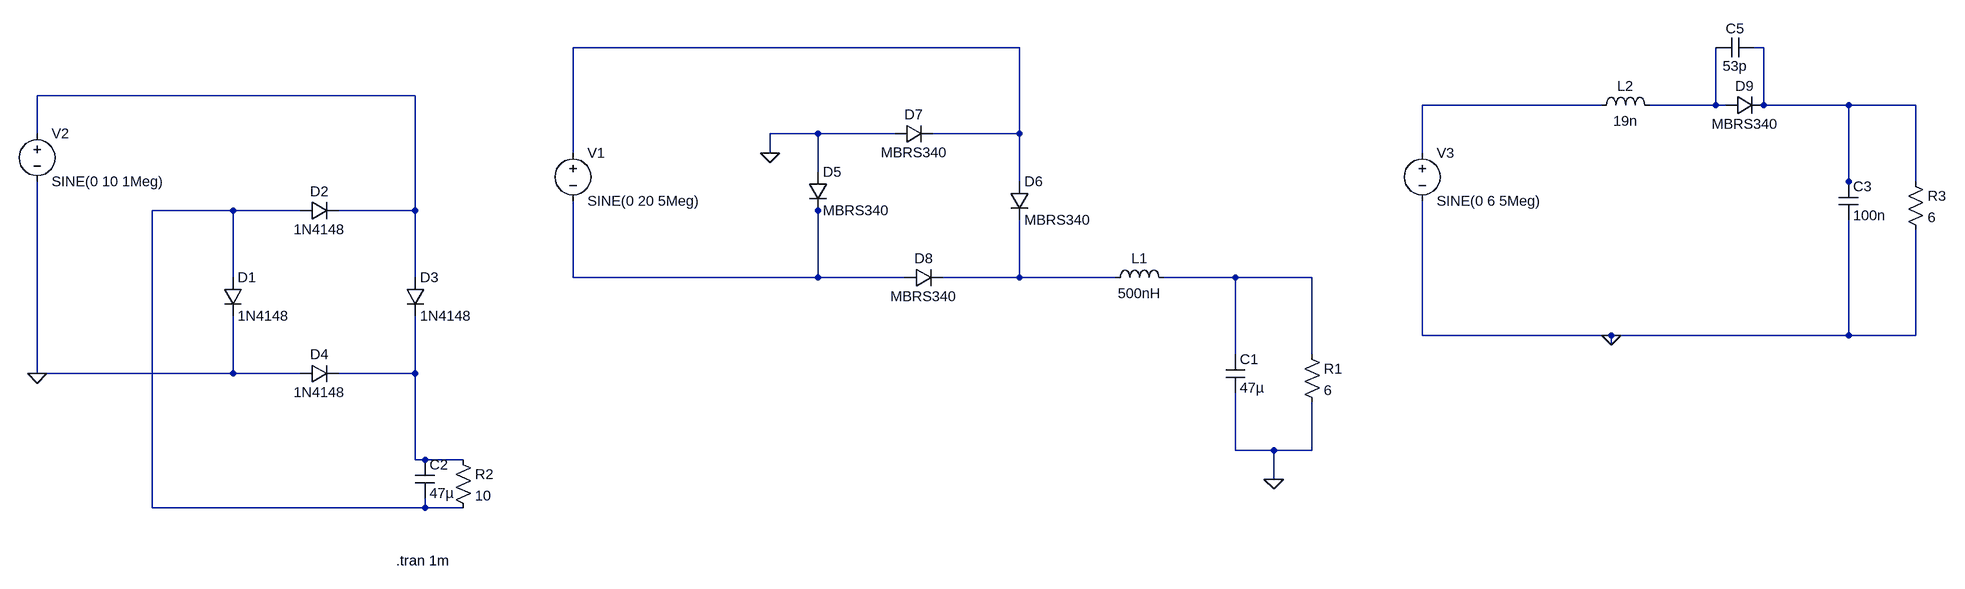
[diagram p0: schematic rectifier.asc]
rectifier.asc, the LTspice schematic file:
Version 4.1
SHEET 1 5448 680
WIRE 3248 -336 2352 -336
WIRE 5104 -336 5088 -336
WIRE 1664 -256 992 -256
WIRE 4800 -240 4416 -240
WIRE 5024 -240 5024 -336
WIRE 5024 -240 4880 -240
WIRE 5040 -240 5024 -240
WIRE 5104 -240 5104 -336
WIRE 5280 -240 5104 -240
WIRE 5392 -240 5280 -240
WIRE 992 -192 992 -256
WIRE 2912 -192 2832 -192
WIRE 3040 -192 2912 -192
WIRE 3248 -192 3248 -336
WIRE 3248 -192 3104 -192
WIRE 2352 -160 2352 -336
WIRE 2832 -160 2832 -192
WIRE 4416 -160 4416 -240
WIRE 2912 -128 2912 -192
WIRE 3248 -112 3248 -192
WIRE 5280 -112 5280 -240
WIRE 5392 -112 5392 -240
WIRE 5280 -96 5280 -112
WIRE 1360 -64 1184 -64
WIRE 1472 -64 1360 -64
WIRE 1664 -64 1664 -256
WIRE 1664 -64 1536 -64
WIRE 2912 -64 2912 -80
WIRE 1360 48 1360 -64
WIRE 1664 48 1664 -64
WIRE 2352 48 2352 -80
WIRE 2912 48 2912 -64
WIRE 2912 48 2352 48
WIRE 3056 48 2912 48
WIRE 3248 48 3248 -48
WIRE 3248 48 3120 48
WIRE 3408 48 3248 48
WIRE 3616 48 3488 48
WIRE 3744 48 3616 48
WIRE 4416 144 4416 -80
WIRE 4816 144 4416 144
WIRE 5280 144 5280 -48
WIRE 5280 144 4816 144
WIRE 5392 144 5392 -32
WIRE 5392 144 5280 144
WIRE 4816 160 4816 144
WIRE 3616 176 3616 48
WIRE 3744 176 3744 48
WIRE 992 208 992 -112
WIRE 1360 208 1360 112
WIRE 1360 208 992 208
WIRE 1472 208 1360 208
WIRE 1664 208 1664 112
WIRE 1664 208 1536 208
WIRE 3616 336 3616 240
WIRE 3680 336 3616 336
WIRE 3744 336 3744 256
WIRE 3744 336 3680 336
WIRE 1664 352 1664 208
WIRE 1680 352 1664 352
WIRE 1744 352 1680 352
WIRE 3680 384 3680 336
WIRE 1184 432 1184 -64
WIRE 1680 432 1680 416
WIRE 1680 432 1184 432
WIRE 1744 432 1680 432
FLAG 992 208 0
FLAG 2832 -160 0
FLAG 3680 384 0
FLAG 4816 144 0
SYMBOL diode 1344 48 R0
SYMATTR InstName D1
SYMATTR Value 1N4148
SYMBOL diode 1472 224 R270
WINDOW 0 32 32 VTop 2
WINDOW 3 0 32 VBottom 2
SYMATTR InstName D4
SYMATTR Value 1N4148
SYMBOL diode 1648 48 R0
SYMATTR InstName D3
SYMATTR Value 1N4148
SYMBOL diode 1472 -48 R270
WINDOW 0 32 32 VTop 2
WINDOW 3 0 32 VBottom 2
SYMATTR InstName D2
SYMATTR Value 1N4148
SYMBOL res 1728 336 R0
SYMATTR InstName R2
SYMATTR Value 10
SYMBOL cap 1664 352 R0
SYMATTR InstName C2
SYMATTR Value 47µ
SYMBOL voltage 992 -208 R0
WINDOW 123 0 0 Left 0
WINDOW 39 0 0 Left 0
SYMATTR InstName V2
SYMATTR Value SINE(0 10 1Meg)
SYMBOL voltage 2352 -176 R0
WINDOW 123 0 0 Left 0
WINDOW 39 0 0 Left 0
SYMATTR InstName V1
SYMATTR Value SINE(0 20 5Meg)
SYMBOL diode 2896 -128 R0
SYMATTR InstName D5
SYMATTR Value MBRS340
SYMBOL diode 3232 -112 R0
SYMATTR InstName D6
SYMATTR Value MBRS340
SYMBOL diode 3040 -176 R270
WINDOW 0 32 32 VTop 2
WINDOW 3 0 32 VBottom 2
SYMATTR InstName D7
SYMATTR Value MBRS340
SYMBOL diode 3056 64 R270
WINDOW 0 32 32 VTop 2
WINDOW 3 0 32 VBottom 2
SYMATTR InstName D8
SYMATTR Value MBRS340
SYMBOL ind 3392 64 R270
WINDOW 0 32 56 VTop 2
WINDOW 3 5 56 VBottom 2
SYMATTR InstName L1
SYMATTR Value 500nH
SYMBOL cap 3600 176 R0
SYMATTR InstName C1
SYMATTR Value 47µ
SYMBOL res 3728 160 R0
SYMATTR InstName R1
SYMATTR Value 6
SYMBOL voltage 4416 -176 R0
WINDOW 123 0 0 Left 0
WINDOW 39 0 0 Left 0
SYMATTR InstName V3
SYMATTR Value SINE(0 6 5Meg)
SYMBOL cap 5264 -112 R0
SYMATTR InstName C3
SYMATTR Value 100n
SYMBOL res 5376 -128 R0
SYMATTR InstName R3
SYMATTR Value 6
SYMBOL ind 4784 -224 R270
WINDOW 0 32 56 VTop 2
WINDOW 3 5 56 VBottom 2
SYMATTR InstName L2
SYMATTR Value 19n
SYMBOL diode 5040 -224 R270
WINDOW 0 32 32 VTop 2
WINDOW 3 0 32 VBottom 2
SYMATTR InstName D9
SYMATTR Value MBRS340
SYMBOL cap 5088 -352 R90
WINDOW 0 0 32 VBottom 2
WINDOW 3 32 32 VTop 2
SYMATTR InstName C5
SYMATTR Value 53p
TEXT 1632 520 Left 2 !.tran 1m

The netlist it stands for:
* rectifier.asc
D1 N006 0 1N4148
D4 0 N010 1N4148
D3 N003 N010 1N4148
D2 N006 N003 1N4148
R2 N010 N006 10
C2 N010 N006 47µ
V2 N003 0 SINE(0 10 1Meg)
V1 N001 N007 SINE(0 20 5Meg)
D5 0 N007 MBRS340
D6 N001 N008 MBRS340
D7 0 N001 MBRS340
D8 N007 N008 MBRS340
L1 N008 N009 500nH
C1 N009 0 47µ
R1 N009 0 6
V3 N004 0 SINE(0 6 5Meg)
C3 N002 0 100n
R3 N002 0 6
L2 N004 N005 19n
D9 N005 N002 MBRS340
C5 N002 N005 53p
.model D D
.lib standard.dio
.tran 1m
.backanno
.end